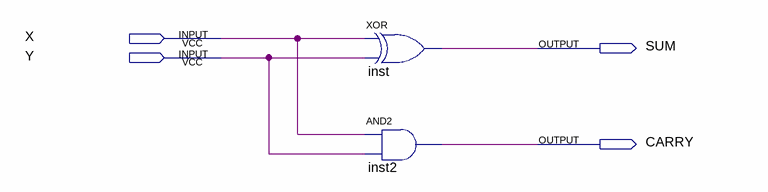
[diagram p0: schematic sheet]
// Quartus schematic halfadder.bdf as structural Verilog: 2 symbols, 4 pins
module halfadder (
  input  X,
  input  Y,
  output SUM,
  output CARRY
);

  xor inst (SUM, X, Y);
  and inst2 (CARRY, X, Y);
endmodule
